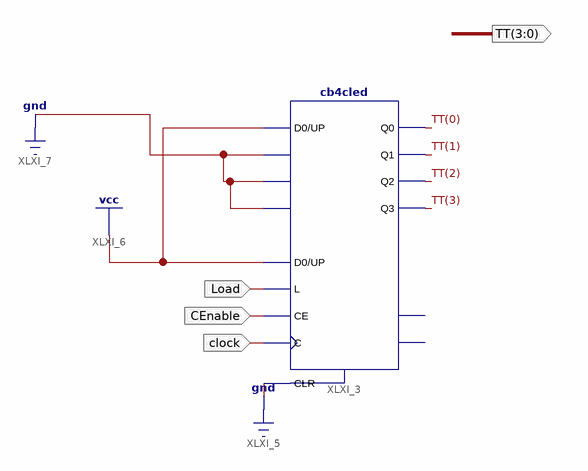
[diagram p0: schematic sheet 1]
// Xilinx ISE schematic Level_Inc.sch (spartan3e) as structural Verilog: 1 symbols, 4 ports
module Level_Inc (
  input  Load,
  input  CEnable,
  input  clock,
  output [3:0] TT
);

  cb4cled XLXI_3 (
    .C(clock), .CE(CEnable), .CLR(1'b0), .D0(1'b1), .D1(1'b0), .D2(1'b0), .D3(1'b0), .L(Load), .UP(1'b1),
    .Q0(TT[0]), .Q1(TT[1]), .Q2(TT[2]), .Q3(TT[3]));  // open: CEO, TC
endmodule
